# Altium schematic sheet Buttons.SchDoc
size A4
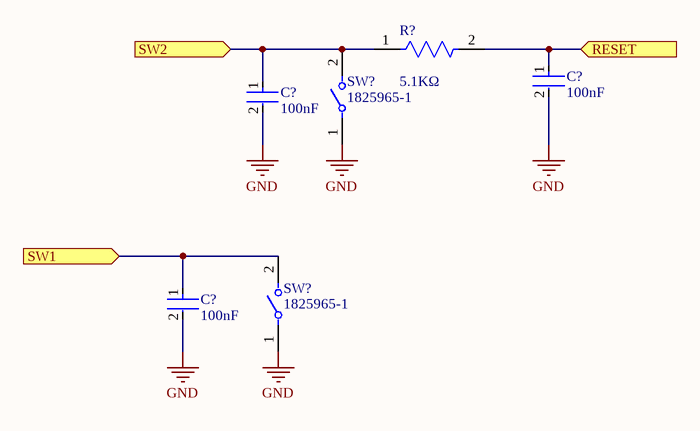
[diagram p0: Buttons.SchDoc]

## Parts
(Parts that share a designator on the sheet are numbered #1, #2 ... from top to bottom, then left to right.)
C?#1  Capacitance: 100nF  [FP-1206-L_3_2_0_2-W_1_6_0-MFG]  (hidden comment: 12061C104KAZ2A)
C?#2  Capacitance: 100nF  [FP-1206-L_3_2_0_2-W_1_6_0-MFG]  (hidden comment: 12061C104KAZ2A)
C?#3  Capacitance: 100nF  [FP-1206-L_3_2_0_2-W_1_6_0-MFG]  (hidden comment: 12061C104KAZ2A)
R?  Resistance: 5.1KΩ  [FP-RT0603-MFG]  (hidden comment: RT0603FRE075K1L)
SW?#1  1825965-1  [FP-1825965-1-MFG]
SW?#2  1825965-1  [FP-1825965-1-MFG]

## Ports
RESET (in), SW1 (in), SW2 (in)

## Nets
GND: C?#1.2 C?#2.2 C?#3.2 SW?#1.1 SW?#2.1
RESET: C?#1.1 R?.2 ; port RESET
SW1: C?#3.1 SW?#2.2 ; port SW1
SW2: C?#2.1 R?.1 SW?#1.2 ; port SW2

## Library data of the parts
C?#1-C?#3 = CMP-04427-004798-1: General Purpose Ceramic Capacitor, 1206, 100nF, 10%, X7R, 15%, 100V; Features: Soft Termination; Termination: SMD/SMT; Mount: Surface Mount; Tolerance: 10%; Voltage Rating: 100V; Length: 3.2mm; Case/Package: 1206; Case Code (Metric): 3216; RoHS Compliant: Yes; Package Quantity: 1; Max Operating Temperature: 125°C; Voltage Rating (DC): 100V; Min Operating Temperature: -55°C; Number of Pins: 2; Packaging: Tape and Reel; Width: 0.063inch; REACH SVHC: No SVHC; Lead Free: Lead Free; Construction: Flat; Radiation Hardening: No; Case Code (Imperial): 1206; Thickness: 0.05inch; Series: FLEXITERM®; Depth: 1.6mm; Dielectric: X7R
R? = CMP-2000-04778-2: RES SMD 5.1K OHM 1% 1/10W 0603; Manufacturer: Yageo; Value: 5.1KΩ; Temperature Coefficient: 50 ppm/°C; Power Rating: 0.1W; Voltage Rating: 75V; Description: RT0603 5.1KΩ 0.1W 50 ppm/°C 1.00%; Tolerance: 0.01; Lead Free: Yes; Temperature Range High: +155°C; Package: RT0603; Series: RT; Footprint Url: http://www.yageo.com/exep/pages/download/literatures/PYu-R_Mount_10.pdf; Ipc Land Pattern Name: RESC16080X45; Mouser Description: Res Thin Film 0603 5.1K Ohm 1% 0.1W(1/10W) ±50ppm/C Epoxy Pad SMD T/R; Octopart: https://octopart.com/rt0603fre075k1l-yageo-1421390; ComponentLink2URL: http://www.yageo.com/documents/recent/PYu-RT_1-to-0.01_RoHS_L_9.pdf; Manufacturer Part Number: RT0603FRE075K1L; RoHS: TRUE; Device Class L3: Chip SMD Resistors; Digikey Description: RES SMD 5.1K OHM 1% 1/10W 0603; Temperature: -55°C to +155°C; Height: 0.55mm; Automotive: No; Device Class L1: Passive Components; Temperature Range Low: -55°C; Category: Res; Composition: Thin Film; ComponentLink2Description: Datasheet; Device Class L2: Resistors
SW?#1 SW?#2 = CMP-03407-000024-1: SWITCH TACTILE SPST-NO 0.05A 24V; Mechanical Life: 100000Cycles; Switch Travel: 0.25mm; Contact Current Rating: 50mA; Actuator Length: 1.52mm; Operating Force: 1.3N; Switch Function: Off-Mom; Contact Resistance: 100mR; Illumination Type: Non-Illuminated; Throw Configuration: SPST; Actuator Material: PBT; Electrical Life: 20000Cycles; Series: FSM, Alcoswitch; Termination: PC Pins; Package Quantity: 1000; Lead Free: Lead Free; Packaging: Loose Piece; Max Operating Temperature: 105°C; Max Voltage Rating (DC): 24V; Max Current Rating: 50mA; Contact Plating: Silver; Length: 3.5mm; Depth: 6.5mm; RoHS Compliant: Yes; ELV: Compliant; Mount: Through Hole; Min Operating Temperature: -35°C; Contact Material: Copper Alloy; Orientation: Straight; Voltage Rating (DC): 24V; Type: Switch